# Altium schematic sheet Gastroscopy-Controller_MPU6500.SchDoc: MPU6500
size 279 x 215 mm; Date: not used; ApprovedBy: not used; CheckedBy: not used; Author: not used; DrawnBy: not used; Organization: not used; Address4: not used; SheetNumber: 8; SheetTotal: 8; Time: not used; ImagePath: not used; Application_BuildNumber: not used
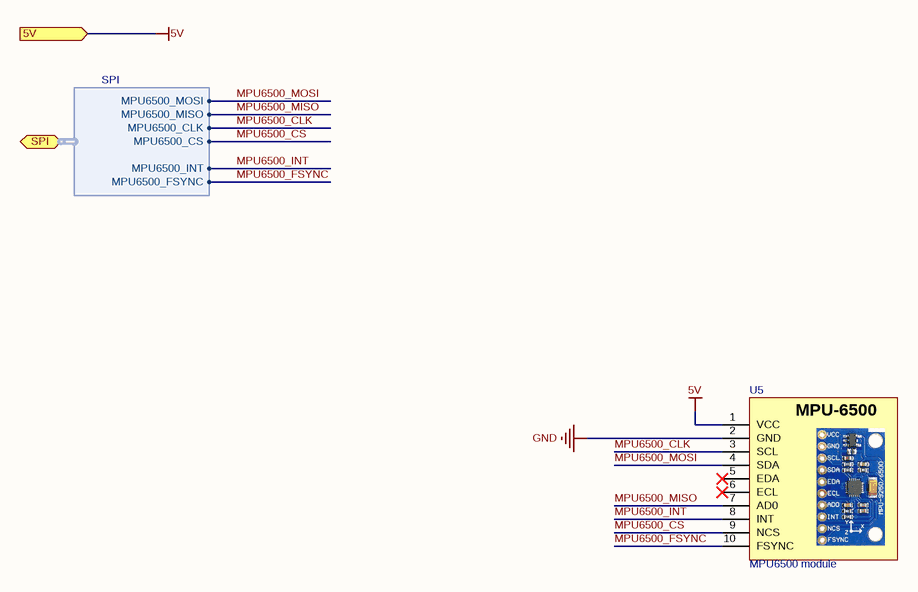
[diagram p0: Gastroscopy-Controller_MPU6500.SchDoc]

## Parts
U5  MPU6500 module  [MPU-6500 module]

## Ports
5V (in), SPI (bidir, harness SPI)

## Harnesses
SPI: MPU6500_MOSI, MPU6500_MISO, MPU6500_CLK, MPU6500_INT, MPU6500_CS, MPU6500_FSYNC

## Nets
5V: U5.1(VCC) ; port 5V
GND: U5.2(GND)
MPU6500_CLK: U5.3(SCL) ; port SPI.MPU6500_CLK
MPU6500_CS: U5.9(NCS) ; port SPI.MPU6500_CS
MPU6500_FSYNC: U5.10(FSYNC) ; port SPI.MPU6500_FSYNC
MPU6500_INT: U5.8(INT) ; port SPI.MPU6500_INT
MPU6500_MISO: U5.7(AD0) ; port SPI.MPU6500_MISO
MPU6500_MOSI: U5.4(SDA) ; port SPI.MPU6500_MOSI

Not connected (* = marked no-connect by the designer): U5 5(EDA)* 6(ECL)*

## Notes on the sheet
- Title:
- Date:
- Size A
- Project:
- Number:
- Time:
- Sheet
- Revision
- of
- Engineer:
- www.mrobots.ru <http://mrobots.ru/>
- File:
- (in symbol MPU6500 module) MPU-6500

## Library data of the parts
U5 = MPU6500 module: EVAL BOARD; Manufacturer 1: Китай; Manufacturer Part Number 1: MPU6500 module